# EAGLE design gps-iridium-tracker (EAGLE 6.4)
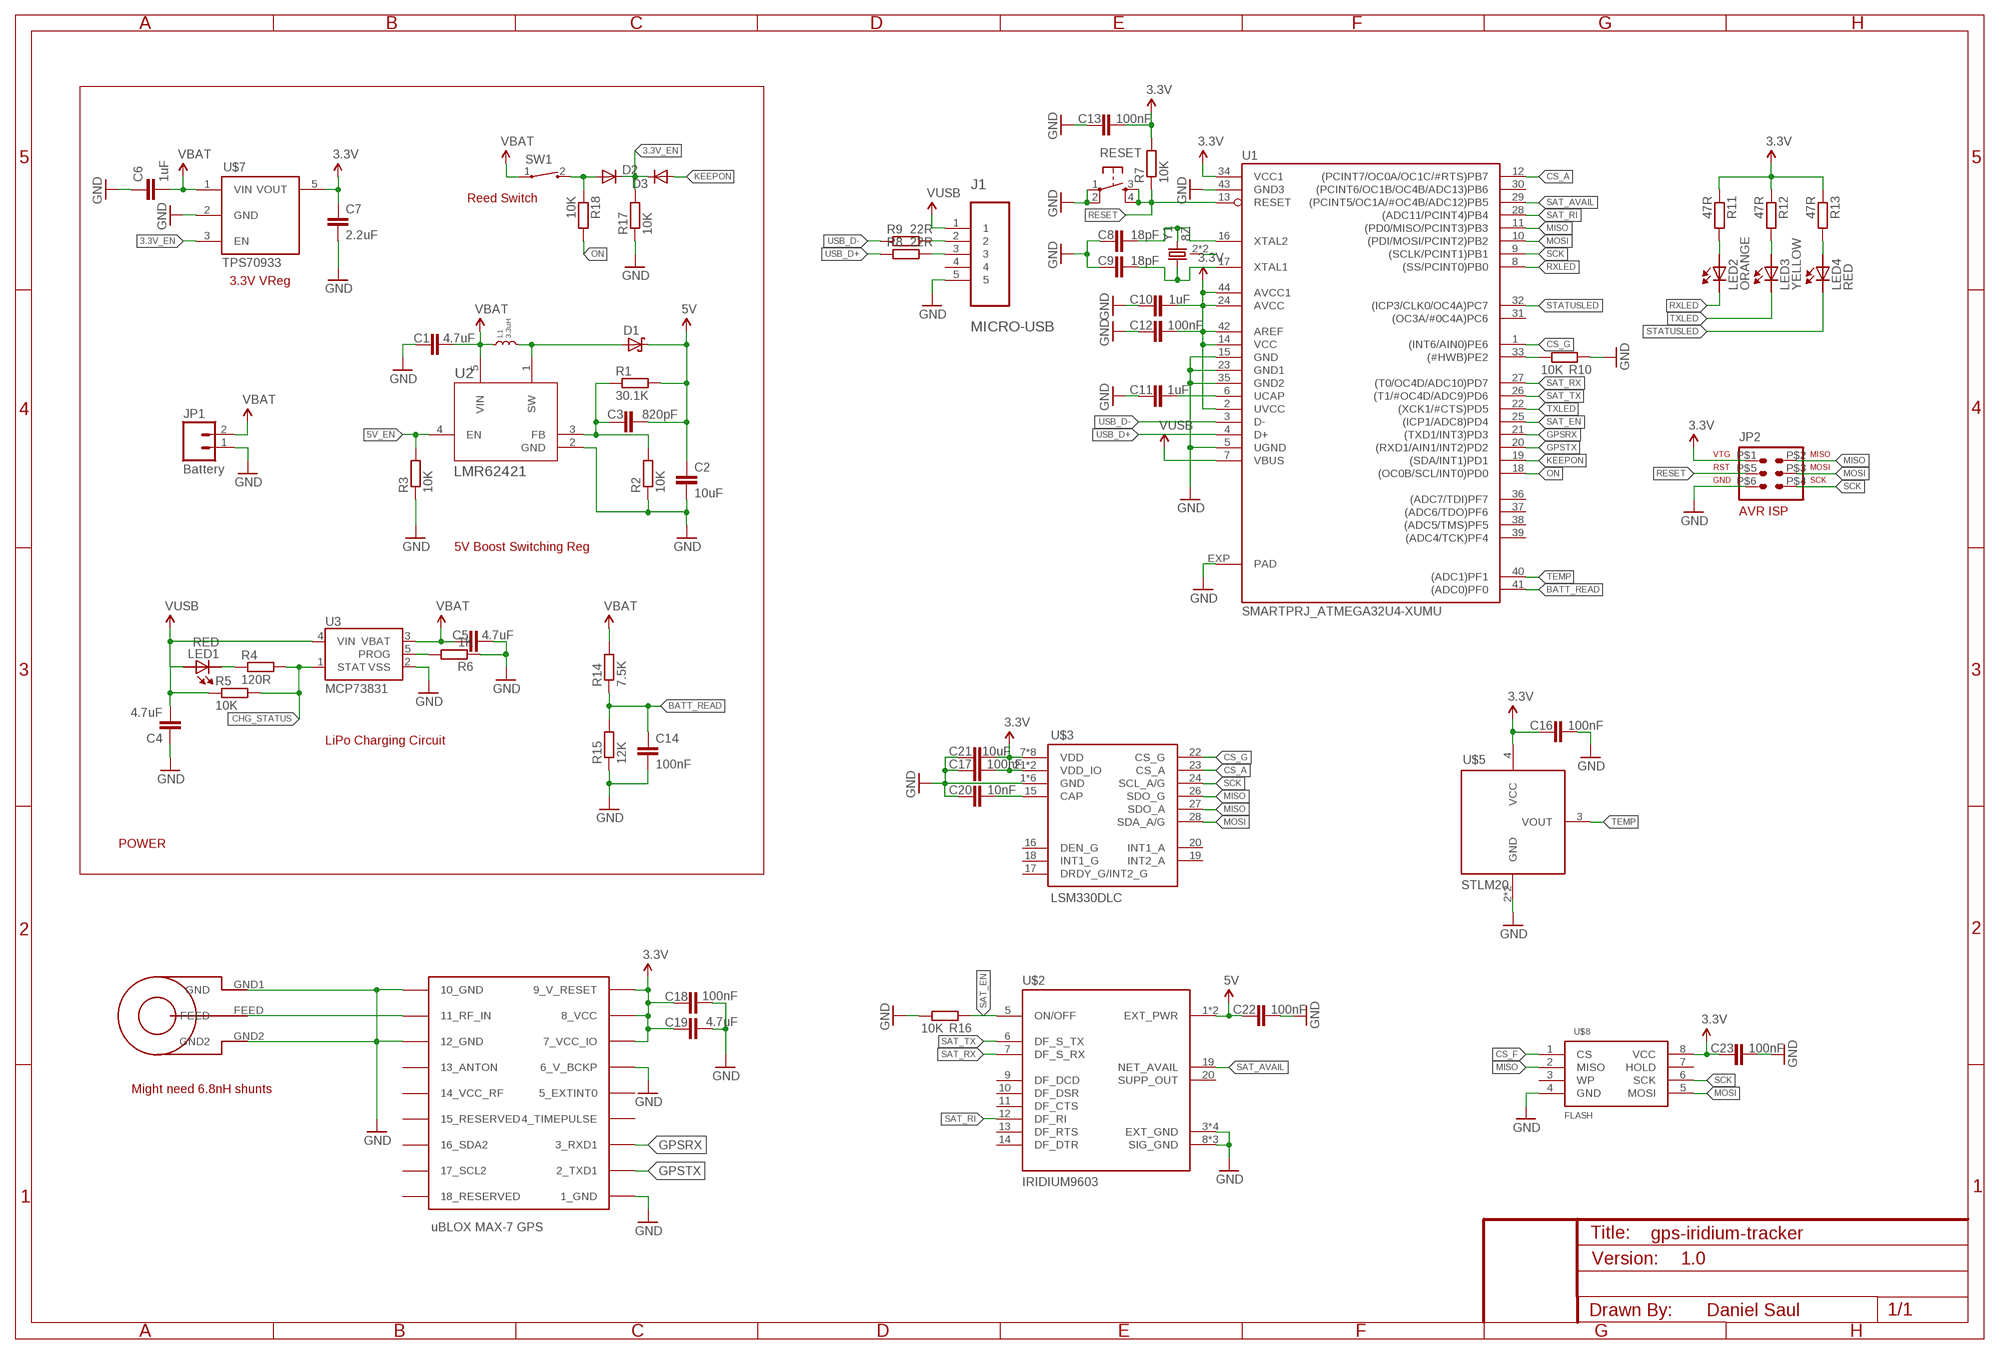
[diagram p0: schematic, sheet 1]

## Parts
C1  4.7uF  CAP0603-CAP  [0603-CAP]
C2  10uF  CAP0603-CAP  [0603-CAP]
C3  820pF  CAP0603-CAP  [0603-CAP]
C4  4.7uF  CAP0603-CAP  [0603-CAP]
C5  4.7uF  CAP0603-CAP  [0603-CAP]
C6  1uF  CAP0603-CAP  [0603-CAP]
C7  2.2uF  CAP0603-CAP  [0603-CAP]
C8  18pF  CAP0603-CAP  [0603-CAP]
C9  18pF  CAP0603-CAP  [0603-CAP]
C10  1uF  CAP0402-CAP  [0402-CAP]
C11  1uF  CAP0402-CAP  [0402-CAP]
C12  100nF  CAP0402-CAP  [0402-CAP]
C13  100nF  CAP0402-CAP  [0402-CAP]
C14  100nF  CAP0402-CAP  [0402-CAP]
C16  100nF  CAP0402-CAP  [0402-CAP]
C17  100nF  CAP0402-CAP  [0402-CAP]
C18  100nF  CAP0402-CAP  [0402-CAP]
C19  4.7uF  CAP0805  [0805]
C20  10nF  CAP0402-CAP  [0402-CAP]
C21  10uF  CAP0402-CAP  [0402-CAP]
C22  100nF  CAP0402-CAP  [0402-CAP]
C23  100nF  CAP0402-CAP  [0402-CAP]
D1  B220A-13-F  [SMA-DIODE]
D2  DIODESOD  [SOD-323]
D3  DIODESOD  [SOD-323]
GPS  UBLOX_MAX-6  [UBLOX_MAX-6]
J1  MICRO-USB  47346-0001  [MOLEX_47346-0001]
JP1  Battery  M02JST-PTH-2  [JST-2-PTH]
JP2  AVR-ISP-6SMD  [ICSPSMD]
L1  3.3uH  INDUCTOR-SRN3015  [SRN3015]
LED1  RED  LED  [R0402]
LED2  ORANGE  LED  [R0402]
LED3  YELLOW  LED  [R0402]
LED4  RED  LED  [R0402]
R1  30.1K  R-EU_R0402  [R0402]
R2  10K  R-EU_R0402  [R0402]
R3  10K  R-EU_R0402  [R0402]
R4  120R  R-EU_R0402  [R0402]
R5  10K  R-EU_R0402  [R0402]
R6  1K  R-EU_R0402  [R0402]
R7  10K  R-EU_R0402  [R0402]
R8  22R  R-EU_R0402  [R0402]
R9  22R  R-EU_R0402  [R0402]
R10  10K  R-EU_R0402  [R0402]
R11  47R  R-EU_R0402  [R0402]
R12  47R  R-EU_R0402  [R0402]
R13  47R  R-EU_R0402  [R0402]
R14  7.5K  R-EU_R0402  [R0402]
R15  12K  R-EU_R0402  [R0402]
R16  10K  R-EU_R0402  [R0402]
R17  10K  R-EU_R0402  [R0402]
R18  10K  R-EU_R0402  [R0402]
RESET  KMR441NGLFS  [KMR441NGLFS]
SW1  CT10-XXXX-G1  [CT10-XXXX-G1]
U1  SMARTPRJ_ATMEGA32U4-XUMU  [SMARTPRJ_QFN44ML7X7]
U2  LMR62421  LMR62421_DBV_5  [MF05A]
U3  MCP73831  [SOT23-5]
U$1  JTI_ANTENNA-1575AT54A0010  [JTI_ANTENNA-1575AT54A0010]
U$2  IRIDIUM9603  [IRIDIUM9603]
U$3  LSM330DLC  [LGA-28L]
U$5  STLM20  [SOT23-5L]
U$7  TPS70933  [SOT23-5L]
U$8  FLASH  SPI_FLASH-X25XXSMD  [SO08]
Y1  8Z  [8Z]

## Nets
3.3V: C7.1 C10.2 C12.2 C13.2 C16.1 C17.2 C18.1 C19.1 C21.2 C23.1 GPS.7_VCC_IO GPS.8_VCC GPS.9_V_RESET JP2.P$1 R7.2 R11.1 R12.1 R13.1 U1.2(UVCC) U1.14(VCC) U1.24(AVCC) U1.34(VCC1) U1.42(AREF) U1.44(AVCC1) U$3.7(VDD) U$3.8(VDD) U$3.9(VDD) U$3.10(VDD) U$3.11(VDD) U$3.12(VDD) U$3.13(VDD) U$3.14(VDD) U$3.21(VDD_IO) U$3.25(VDD_IO) U$5.4(VCC) U$7.5(VOUT) U$8.8(VCC)
3.3V_EN: D2.1(C) D3.1(C) R17.2 U$7.3(EN)
5V: C2.1 C3.2 C22.1 D1.2(C) R1.2 U$2.1(EXT_PWR) U$2.2(EXT_PWR)
5V_EN: R3.2 U2.4(EN)
BATT_READ: C14.1 R14.1 R15.2 U1.41((ADC0)PF0)
CHG_STATUS: R4.2 R5.2 U3.1(STAT)
CS_A: U1.12((PCINT7/OC0A/OC1C/#RTS)PB7) U$3.23(CS_A)
CS_F: U$8.1(CS)
CS_G: U1.1((INT6/AIN0)PE6) U$3.22(CS_G)
GND: C1.1 C2.2 C4.1 C5.2 C6.1 C7.2 C8.1 C9.1 C10.1 C11.1 C12.1 C13.1 C14.2 C16.2 C17.1 C18.2 C19.2 C20.1 C21.1 C22.2 C23.2 GPS.1_GND GPS.6_V_BCKP GPS.10_GND GPS.12_GND J1.5 JP1.1 JP2.P$6 R2.1 R3.1 R6.1 R10.1 R15.1 R16.2 R17.1 RESET.1(P) RESET.2(P1) U1.5(UGND) U1.15(GND) U1.23(GND1) U1.35(GND2) U1.43(GND3) U1.EXP(PAD) U2.2(GND) U3.2(VSS) U$1.GND1(GND) U$1.GND2 U$2.3(EXT_GND) U$2.4(EXT_GND) U$2.8(SIG_GND) U$2.15(SIG_GND) U$2.18(SIG_GND) U$2.HOLE1(EXT_GND) U$2.HOLE2(EXT_GND) U$3.1(GND) U$3.2(GND) U$3.3(GND) U$3.4(GND) U$3.5(GND) U$3.6(GND) U$5.2(GND) U$5.5(GND) U$7.2(GND) U$8.4(GND) Y1.2(GND) Y1.4(GND)
GPSRX: GPS.3_RXD1 U1.21((TXD1/INT3)PD3)
GPSTX: GPS.2_TXD1 U1.20((RXD1/AIN1/INT2)PD2)
KEEPON: D3.2(A) U1.19((SDA/INT1)PD1)
MISO: JP2.P$2 U1.11((PD0/MISO/PCINT3)PB3) U$3.26(SDO_G) U$3.27(SDO_A) U$8.2(MISO)
MOSI: JP2.P$3 U1.10((PDI/MOSI/PCINT2)PB2) U$3.28(SDA_A/G) U$8.5(MOSI)
N$1: GPS.11_RF_IN U$1.FEED
N$3: D1.1(A) L1.2 U2.1(SW)
N$4: C3.1 R1.1 R2.2 U2.3(FB)
N$5: LED1.1(C) R4.1
N$6: R6.2 U3.5(PROG)
N$8: C8.2 U1.16(XTAL2) Y1.3
N$9: C9.2 U1.17(XTAL1) Y1.1
N$10: C11.2 U1.6(UCAP)
N$11: J1.2 R9.2
N$12: J1.3 R8.2
N$13: R10.2 U1.33((#HWB)PE2)
N$14: C20.2 U$3.15(CAP)
N$15: LED4.2(A) R13.2
N$16: LED2.2(A) R11.2
N$17: LED3.2(A) R12.2
N$18: D2.2(A) R18.1 SW1.2
ON: R18.2 U1.18((OC0B/SCL/INT0)PD0)
RESET: JP2.P$5 R7.1 RESET.3(S) RESET.4(S1) U1.13(RESET)
RXLED: LED2.1(C) U1.8((SS/PCINT0)PB0)
SAT_AVAIL: U1.29((PCINT5/OC1A/#OC4B/ADC12)PB5) U$2.19(NET_AVAIL)
SAT_EN: R16.1 U1.25((ICP1/ADC8)PD4) U$2.5(ON/OFF)
SAT_RI: U1.28((ADC11/PCINT4)PB4) U$2.12(DF_RI)
SAT_RX: U1.27((T0/OC4D/ADC10)PD7) U$2.7(DF_S_RX)
SAT_TX: U1.26((T1/#OC4D/ADC9)PD6) U$2.6(DF_S_TX)
SCK: JP2.P$4 U1.9((SCLK/PCINT1)PB1) U$3.24(SCL_A/G) U$8.6(SCK)
STATUSLED: LED4.1(C) U1.32((ICP3/CLK0/OC4A)PC7)
TEMP: U1.40((ADC1)PF1) U$5.3(VOUT)
TXLED: LED3.1(C) U1.22((XCK1/#CTS)PD5)
USB_D+: R8.1 U1.4(D+)
USB_D-: R9.1 U1.3(D-)
VBAT: C1.2 C5.1 C6.2 JP1.2 L1.1 R14.2 SW1.1 U2.5(VIN) U3.3(VBAT) U$7.1(VIN)
VUSB: C4.2 J1.1 LED1.2(A) R5.1 U1.7(VBUS) U3.4(VIN)
Unconnected: GPS.4_TIMEPULSE GPS.5_EXTINT0 GPS.13_ANTON GPS.14_VCC_RF GPS.15_RESERVED GPS.16_SDA2 GPS.17_SCL2 GPS.18_RESERVED J1.4 U1.30((PCINT6/OC1B/OC4B/ADC13)PB6) U1.31((OC3A/#0C4A)PC6) U1.36((ADC7/TDI)PF7) U1.37((ADC6/TDO)PF6) U1.38((ADC5/TMS)PF5) U1.39((ADC4/TCK)PF4) U$2.9(DF_DCD) U$2.10(DF_DSR) U$2.11(DF_CTS) U$2.13(DF_RTS) U$2.14(DF_DTR) U$2.20(SUPP_OUT) U$3.16(DEN_G) U$3.17(DRDY_G/INT2_G) U$3.18(INT1_G) U$3.19(INT2_A) U$3.20(INT1_A) U$8.3(WP) U$8.7(HOLD)

## Notes on the sheet
- Reed Switch
- 3.3V VReg
- 5V Boost Switching Reg
- LiPo Charging Circuit
- POWER
- Might need 6.8nH shunts
- uBLOX MAX-7 GPS
- 1.0
- Daniel Saul

## Library data of the parts
C1-C14 C16 C17 C20-C23 = SparkFun-Passives:CAP: Capacitor Standard 0603 ceramic capacitor, and 0.1" leaded capacitor.
C18 C19 = apex:CAP: Capacitor Standard 0603 ceramic capacitor, and 0.1" leaded capacitor.
D1 = !danielparts:B220A-13-F
D2 D3 = apex:DIODE: Diode These are standard reverse protection diodes and small signal diodes. SMA package can handle up to about 1A. SOD-323 can handle about 200mA. What the SOD-323 package when ordering, there are some mfgs out there that are 5-pin packages.
GPS = Ava:UBLOX_MAX-6: UBLOX MAX-6
J1 = Molex-47346-0001:47346-0001: CONN RCPT 5POS MICRO USB R/A SMD; MPN: 47346-0001; OC_FARNELL: 1568026; OC_NEWARK: 47M0505; PACKAGE: 5 POS MICRO USB R/A; SUPPLIER: MOLEX
JP1 = SparkFun-Connectors:M02: Standard 2-pin 0.1" header. Use with - straight break away headers ( PRT-00116) - right angle break away headers (PRT-00553) - swiss pins (PRT-00743) - machine pins (PRT-00117) - female headers (PRT-00115) Molex polarized connector foot print use with: PRT-08233 with associated crimp pins and housings. 2.54_SCREWTERM for use with PRT-10571. 3.5mm Screw Terminal footprints for PRT-08084 5mm Screw Terminal footprints for use with PRT-08433
JP2 = apex:AVR-ISP-6: AVR ISP-6 Serial Programming Header
L1 = bourns:INDUCTOR
LED1-LED4 = apex:LED: SMD LED
R1-R18 = apex:R-EU_: RESISTOR, European symbol
RESET = apex:KMR441NGLFS
SW1 = switch-coto:CT10-XXXX-: CT10 Series Molded Switch Source: www.cotorelay.com .. Coto_Technology__CT10-1530-G1.pdf
U1 = gps-iridium-tracker:SMARTPRJ_ATMEGA32U4-XU
U2 = lmr62421:LMR62421_DBV_5; BASEPN: LMR62421; DATASHEETURL: http://www.ti.com/lit/ds/symlink/lmr62421.pdf; DESCRIPTION: SIMPLE SWITCHER 24Vout, 2.1A Step-Up Voltage Regulator in SOT-23; MANUFACTURER: Texas Instruments; MANUFACTURER_PART_NUMBER: lmr62421_dbv_5; NSC_PACKAGEREFERENCE: MF05A; VENDOR: Texas Instruments
U3 = SparkFun-PowerIC:MCP73831: Miniature single cell, fully integrated Li-Ion, Li-polymer charge management controller http://ww1.microchip.com/downloads/en/DeviceDoc/21984a.pdf IC-09995; PROD_ID: IC-09995
U$1 = Ava:JTI_ANTENNA-1575AT54A0010
U$2 = !danielparts:IRIDIUM9603
U$3 = LSM330DLC:LSM330DLC
U$5 = !danielparts:STLM20
U$7 = !danielparts:TPS70933
U$8 = SparkFun-DigitalIC:SPI_FLASH-X25XX: 8pin SPI Flash series x25xx. Works with devices like W25X32 and BR25L32
Y1 = !danielparts:8Z

## Board
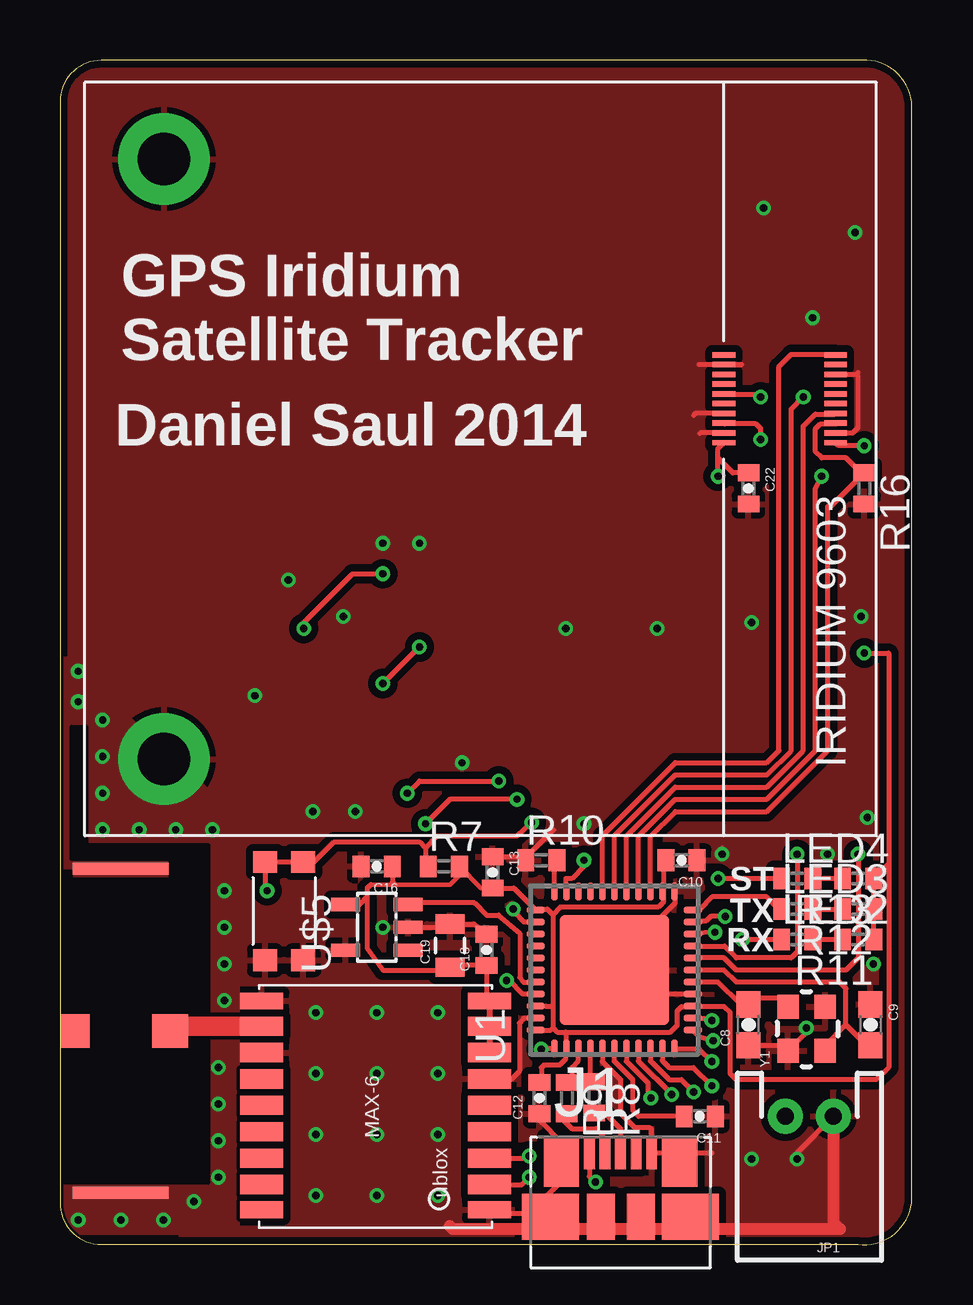
[diagram p1: board, top side]
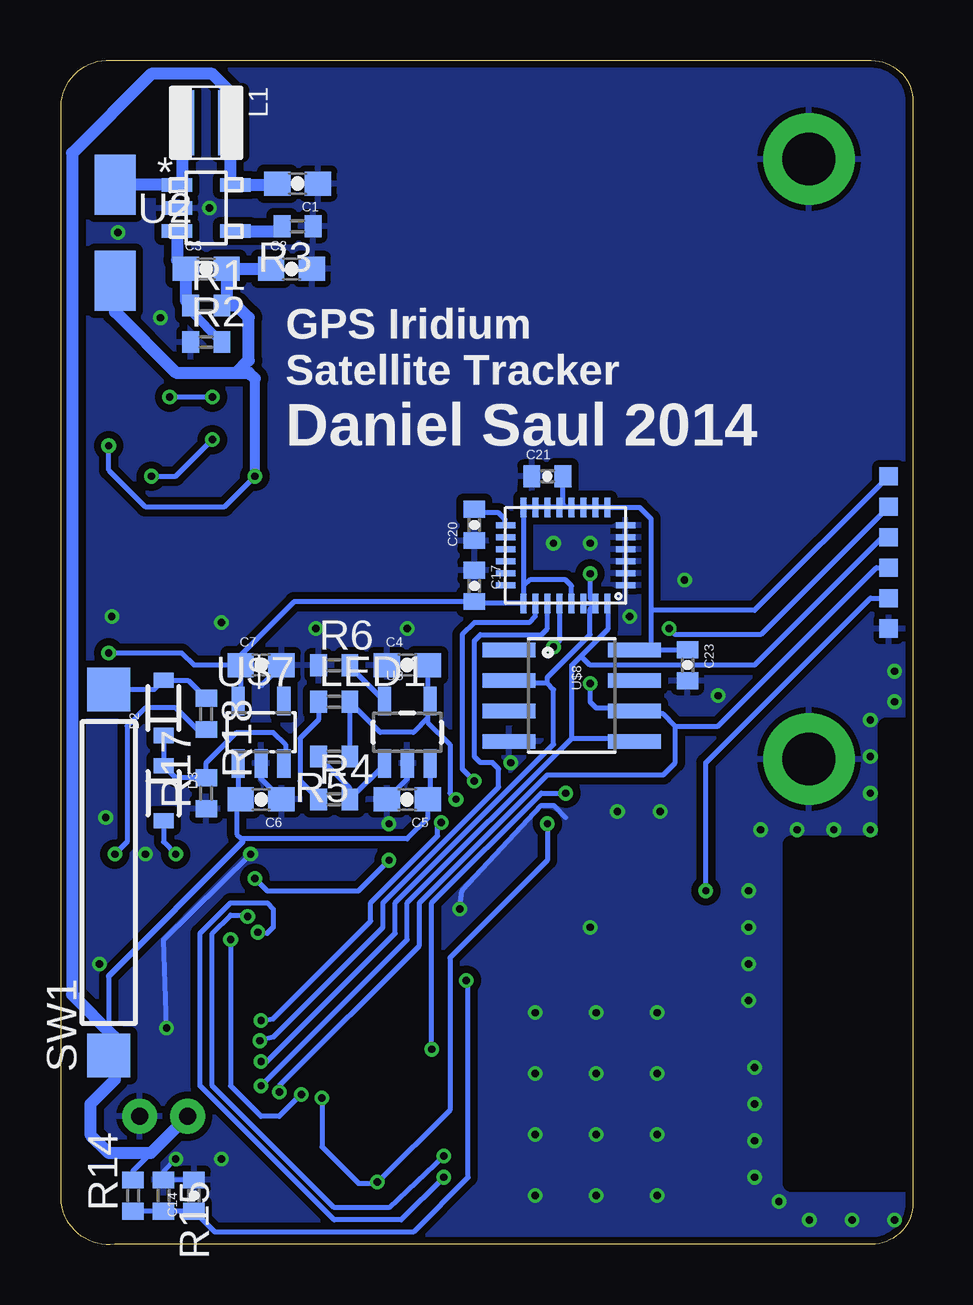
[diagram p2: board, bottom side, seen from below]

Size 35.51 x 49.36 mm. Coordinates in mm from the lower left corner, seen from the top.
Outline: 33.27,49.35 1.73,49.35 arc90 0,47.62 0,1.74 arc90 1.73,0.01 33.27,0.01 arc90 35.51,1.74 35.51,47.62 arc90 33.27,49.35
Copper layers (1*16): Top 0.035mm / dielectric 1.5mm / Bottom 0.035mm
Design rules "Fusion_eagle_rule_v1.1 *": minimum track width 6mil, minimum drill 12mil, track to track 6mil, track to pad 6mil, pad to pad 6mil, via to via 6mil, smd to smd 0mil, copper to edge 5mil, drill to drill 10mil, minimum pad ring 10mil, minimum via ring 6mil, stop-mask expansion 2mil, vias tented up to drill 100mil, thermal gap 10mil

### Footprints (pad centres in the part's own frame; a part is rotated, then mirrored left to right if it is on the bottom)
0603-CAP = smd 1.1 x 1: 1 -0.85,0; 2 0.85,0
0402-CAP = smd 0.7 x 0.9: 1 -0.65,0; 2 0.65,0
0805 = smd 0.8 x 1.2: 1 -0.9,0; 2 0.9,0
SMA-DIODE = smd 2.5 x 1.7: 1 -1.992,0.015; 2 2.008,0.015
SOD-323 = smd 0.63 x 0.83: 1 -1.15,0; 2 1.15,0
UBLOX_MAX-6 = smd 1.8 x 0.7: 1_GND 4.95,-4.4; 9_V_RESET 4.95,4.3; 10_GND -4.55,4.3; 18_RESERVED -4.55,-4.4 | smd 1.8 x 0.8: 2_TXD1 4.95,-3.35; 3_RXD1 4.95,-2.25; 4_TIMEPULSE 4.95,-1.15; 5_EXTINT0 4.95,-0.05; 6_V_BCKP 4.95,1.05; 7_VCC_IO 4.95,2.15; 8_VCC 4.95,3.25; 11_RF_IN -4.55,3.25; 12_GND -4.55,2.15; 13_ANTON -4.55,1.05; 14_VCC_RF -4.55,-0.05; 15_RESERVED -4.55,-1.15; 16_SDA2 -4.55,-2.25; 17_SCL2 -4.55,-3.35
MOLEX_47346-0001 = smd 0.45 x 1.38: 1 -1.3,0; 2 -0.65,0; 3 0,0; 4 0.65,0; 5 1.3,0 | smd 1.475 x 2.1: M1 -2.462,-0.36; M2 2.462,-0.36 | smd 2.375 x 1.9: M3 -2.913,-2.66; M6 2.913,-2.66 | smd 1.175 x 1.9: M4 -0.82,-2.66; M5 0.85,-2.66
JST-2-PTH = drill 0.7 pad 1.448: 1 -1,0; 2 1,0
ICSPSMD = smd 0.762 x 0.762: P$1 -1.27,0; P$2 0,0; P$3 1.27,0; P$4 2.54,0; P$5 3.81,0; P$6 5.08,0
SRN3015 = smd 2.7 x 1: 1 0,1; 2 0,-1
R0402 = smd 0.7 x 0.9: 1 -0.65,0; 2 0.65,0
KMR441NGLFS = smd 0.9 x 1: 1 2.132,0.746; 2 2.132,-0.854; 3 -1.968,0.746; 4 -1.968,-0.854
CT10-XXXX-G1 = smd 1.8 x 1.8: 1 -7.625,0; 2 7.625,0
SMARTPRJ_QFN44ML7X7 = smd 0.75 x 0.275: 1 -3.275,2.5; 2 -3.275,2; 3 -3.275,1.5; 4 -3.275,1; 5 -3.275,0.5; 6 -3.275,0; 7 -3.275,-0.5; 8 -3.275,-1; 9 -3.275,-1.5; 10 -3.275,-2; 11 -3.275,-2.5; 23 3.275,-2.5; 24 3.275,-2; 25 3.275,-1.5; 26 3.275,-1; 27 3.275,-0.5; 28 3.275,0; 29 3.275,0.5; 30 3.275,1; 31 3.275,1.5; 32 3.275,2; 33 3.275,2.5 | smd 0.275 x 0.75: 12 -2.5,-3.275; 13 -2,-3.275; 14 -1.5,-3.275; 15 -1,-3.275; 16 -0.5,-3.275; 17 0,-3.275; 18 0.5,-3.275; 19 1,-3.275; 20 1.5,-3.275; 21 2,-3.275; 22 2.5,-3.275; 34 2.5,3.275; 35 2,3.275; 36 1.5,3.275; 37 1,3.275; 38 0.5,3.275; 39 0,3.275; 40 -0.5,3.275; 41 -1,3.275; 42 -1.5,3.275; 43 -2,3.275; 44 -2.5,3.275 | smd 4.572 x 4.572: EXP 0,0
MF05A = smd 1.27 x 0.559: 1 -1.219,0.965; 2 -1.219,0; 3 -1.219,-0.965; 4 1.219,-0.965; 5 1.219,0.965
SOT23-5 = smd 0.55 x 1.2: 1 -0.95,-1.3; 2 0,-1.3; 3 0.95,-1.3; 4 0.95,1.3; 5 -0.95,1.3
JTI_ANTENNA-1575AT54A0010 = smd 1.5 x 1.4: FEED -2.05,0 | smd 4 x 0.5: GND1 0,6.75; GND2 0,-6.75 | smd 1.2 x 1.4: NC 1.9,0
IRIDIUM9603 = smd 0.229 x 0.94: 1 16.381,1.712; 2 16.381,6.36; 3 16.788,1.712; 4 16.788,6.36; 5 17.194,1.712; 6 17.194,6.36; 7 17.6,1.712; 8 17.6,6.36; 9 18.007,1.712; 10 18.007,6.36; 11 18.413,1.712; 12 18.413,6.36; 13 18.82,1.712; 14 18.82,6.36; 15 19.226,1.712; 16 19.226,6.36; 17 19.632,1.712; 18 19.632,6.36; 19 20.039,1.712; 20 20.039,6.36 | drill 2.2 pad 3.81: HOLE1 3.2,29.7; HOLE2 28.2,29.7
LGA-28L = smd 0.8 x 0.25: 1 2.5,-1.25; 2 2.5,-0.75; 3 2.5,-0.25; 4 2.5,0.25; 5 2.5,0.75; 6 2.5,1.25; 15 -2.5,1.25; 16 -2.5,0.75; 17 -2.5,0.25; 18 -2.5,-0.25; 19 -2.5,-0.75; 20 -2.5,-1.25 | smd 0.25 x 0.8: 7 1.75,2; 8 1.25,2; 9 0.75,2; 10 0.25,2; 11 -0.25,2; 12 -0.75,2; 13 -1.25,2; 14 -1.75,2; 21 -1.75,-2; 22 -1.25,-2; 23 -0.75,-2; 24 -0.25,-2; 25 0.25,-2; 26 0.75,-2; 27 1.25,-2; 28 1.75,-2
SOT23-5L = smd 0.55 x 1.2: 1 -0.95,-1.3; 2 0,-1.3; 3 0.95,-1.3; 4 0.95,1.3; 5 -0.95,1.3
SO08 = smd 0.61 x 2.21: 1 -1.905,-2.616; 2 -0.635,-2.616; 3 0.635,-2.616; 4 1.905,-2.616; 5 1.905,2.616; 6 0.635,2.616; 7 -0.635,2.616; 8 -1.905,2.616
8Z = smd 1 x 0.9: 1 -1.85,-0.4; 2 0,-0.4; 3 0,1.15; 4 -1.85,1.15

### Placement (x,y rotation side)
C1  25.65,44.21 180 bottom
C2  25.91,40.65 0 bottom
C3  29.46,40.65 0 bottom
C4  21.08,24.14 0 bottom
C5  21.08,18.56 180 bottom
C6  27.18,18.56 180 bottom
C7  27.18,24.14 0 bottom
C8  28.7,9.16 90 top
C9  33.78,9.16 270 top
C10  25.91,16.02 180 top
C11  26.67,5.35 180 top
C12  19.99,6.11 90 top
C13  18.03,15.51 270 top
C14  29.97,2.05 90 bottom
C16  13.21,15.76 180 top
C17  18.29,27.45 270 bottom
C18  17.78,12.28 90 top
C19  16.26,12.46 90 top
C20  18.29,29.99 90 bottom
C21  15.24,32.02 0 bottom
C22  28.7,31.51 270 top
C23  9.4,24.14 270 bottom
D1  33.27,42.18 270 bottom
D2  31.24,22.37 90 bottom
D3  31.24,18.81 270 bottom
GPS  12.95,5.86 0 top
J1  23.37,3.82 0 top
JP1  31.24,5.35 180 top
JP2  1.02,30.75 270 bottom
L1  29.46,46.75 270 bottom
LED1  24.13,22.62 0 bottom
LED2  30.73,12.71 0 top
LED3  30.73,13.98 0 top
LED4  30.73,15.25 0 top
R1  29.46,39.13 0 bottom
R2  29.46,37.61 0 bottom
R3  25.65,42.43 180 bottom
R4  24.13,18.56 0 bottom
R5  24.13,20.33 180 bottom
R6  24.13,24.14 0 bottom
R7  16,15.76 0 top
R8  22.28,6.14 270 top
R9  21.13,6.11 270 top
R10  20.07,16.02 0 top
R11  33.27,12.71 180 top
R12  33.27,13.98 180 top
R13  33.27,15.25 180 top
R14  32.51,2.05 90 bottom
R15  31.24,2.05 270 bottom
R16  33.53,31.51 270 top
R17  29.46,18.81 90 bottom
R18  29.46,22.11 270 bottom
RESET  9.4,13.98 270 top
SW1  33.53,15.51 90 bottom
U1  23.11,11.44 90 top
U2  29.46,43.19 0 bottom
U3  21.08,21.35 0 bottom
U$1  2.54,8.9 180 top
U$2  34.04,17.03 90 top
U$3  14.48,28.72 0 bottom
U$5  13.21,13.22 90 top
U$7  27.18,21.35 0 bottom
U$8  14.22,22.87 270 bottom
Y1  31.5,9.92 90 top

### Tracks (layer width: path | path; a pad name or v marks a point on that pad's centre or on a via)
3.3V  (via drill 0.3 pad 0.41)
  Top 0.178: 21.13,8.19 U1.2 | 19.85,8.96 U1.44 | U1.42 20.25,9.94 | C13.2 17.56,14.86 R7.2 16.65,15.4 16.26,15 13.97,15 12.95,15 | 19.88,13.98 U1.34
  Top 0.203: C13.2 18.93,14.86 U1.34 | C10.2 25.15,16.02 25.15,14.75 | 25.15,14.75 U1.24 | R11.1 R12.1 R13.1 34.54,15.87 | v33.53,24.65 34.54,24.65 34.54,15.87 | 34.54,15.87 34.54,7.38 34.04,6.87 28.19,6.87 27.94,7.13 27.94,9.67 27.69,9.92 26.41,9.92 U1.14 26.36,9.92 25.91,9.92 25.73,9.74 25.73,9.13 25.45,8.85 21.08,8.85 | 17.66,10.16 GPS.9_V_RESET 17.78,10.28 C18.1 16.33,11.63 C19.1 | 12.81,14.49 12.81,14.86 12.95,15 | 12.81,14.49 12.81,12.35 13.46,11.44 16.14,11.44 C19.1 | C19.1 | U$5.4 12.49,14.17 12.81,14.49 | C16.1 13.86,15.11 13.97,15 | C12.2 20.07,6.84 20.07,7.38 20.17,7.48 20.83,7.48 21.08,7.74 21.08,8.14 U1.2 21.11,8.82 21.08,8.85 | 25.15,14.75 25.15,14.26 24.94,14.06 20.85,14.06 20.55,13.76 | 20.55,13.76 20.55,9.92 | 20.55,9.92 20.55,9.03 | 20.55,9.03 20.73,8.85 21.08,8.85 | 19.88,13.98 20.32,13.98 20.55,13.76 | 20.25,9.94 20.52,9.94 20.55,9.92 | U1.44 20.46,8.94 20.55,9.03
  Top 0.254: GPS.9_V_RESET GPS.8_VCC GPS.7_VCC_IO
  Bottom 0.178: 28.03,22.75 U$7.5
  Bottom 0.203: 28.03,22.75 C7.1 28.45,24.14 | 28.45,24.14 29.97,24.14 30.48,24.65 v33.53,24.65 | U$3.11 U$3.10 U$3.9 U$3.8 U$3.7 11.4,30.72 10.92,30.24 10.92,26.43 | U$3.11 U$3.12 U$3.13 U$3.14 16.23,27.45 | 16.23,27.45 U$3.21 18.21,26.72 C17.2 25.8,26.8 28.45,24.14 | U$3.25 14.23,27.45 14.48,27.7 15.97,27.7 16.23,27.45 | U$3.11 14.59,30.85 C21.2 | U$8.8 10.92,24.78 | 10.92,24.78 10.18,24.78 C23.1 | 10.92,26.43 10.92,24.78 | JP2.P$1 6.6,26.43 10.92,26.43
3.3V_EN
  Bottom 0.203: D2.1 D3.1 30.74,19.46 R17.2 29.46,20.08 28.19,21.35 26.67,21.35 26.16,20.84 26.16,20.12 U$7.3
5V  (via drill 0.3 pad 0.41)
  Top 0.203: 27.43,32.78 27.43,33.17 U$2.2 | C22.1 28.05,32.16 27.43,32.78 | v33.53,33.29 32.45,33.29 U$2.1 | v27.43,32.02 27.43,32.78
  Bottom 0.203: v33.53,33.29 33.53,32.27 32,30.75 28.7,30.75 v27.43,32.02
  Bottom 0.406: v27.43,32.02 27.43,36.08
  Bottom 0.508: C2.1 C3.2 28.61,39.33 R1.2 28.19,39.13 27.69,38.62 27.69,36.84 28.19,36.34 | D1.2 33.26,38.86 30.73,36.34 28.19,36.34 | 28.19,36.34 27.69,36.34 27.43,36.08
5V_EN
  Bottom 0.508: U2.4 26.51,42.23 R3.2
BATT_READ  (via drill 0.3 pad 0.41)
  Top 0.203: U1.41 19.29,10.44 18.72,11.01 v18.62,11.01
  Bottom 0.203: R14.1 R15.2 C14.1 29.1,0.52 20.83,0.52 18.54,2.81 18.54,10.94 v18.62,11.01
CHG_STATUS
  Bottom 0.203: U3.1 22.03,20 R4.2 23.48,19.03 R5.2
CS_A  (via drill 0.3 pad 0.41)
  Top 0.203: v27.23,8.5 26.68,8.65 U1.12
  Bottom 0.203: v27.23,8.5 26.67,8.65 22.1,13.22 22.1,14.24 17.27,19.06 17.27,19.83 17.53,20.08 18.03,20.08 18.29,20.33 18.29,25.16 18.03,25.41 15.49,25.41 15.24,25.67 U$3.23
CS_G  (via drill 0.3 pad 0.41)
  Top 0.203: U1.1 20.09,8.17 v20.07,8.14 | v14.48,18.81 14.99,19.32 v18.29,19.32
  Bottom 0.203: v20.07,8.14 20.07,14.24 15.49,18.81 v14.48,18.81 | U$3.22 15.75,26.7 15.75,26.18 16,25.92 18.29,25.92 18.8,25.41 18.8,19.83 v18.29,19.32
GND  (via drill 0.3 pad 0.41)
  Top 0.178: v30.73,3.57 30.73,3.84
  Top 0.203: U$2.15 33.2,36.26 | 33.2,36.26 33.27,36.34 | U$2.3 33.04,33.82 33.27,34.05 33.27,36.18 33.2,36.26 | 30.73,3.84 JP1.1 | U$5.2 16.12,13.22 C19.2 17.28,13.36 C18.2 | C8.1 30.11,8.31 Y1.4 | C13.1 19.27,16.16 R10.1 19.42,16.13 20.57,17.29 | U$2.18 28.37,36.66 28.42,36.67 26.64,36.67 | U$2.4 26.69,33.82 26.67,33.8 | U$2.8 26.49,34.63 26.42,34.56 | C12.1 20.07,5.09 20.83,4.33 20.83,2.55 19.56,1.28 18.08,1.28 GPS.1_GND | Y1.4 30.41,8.07 | v27.61,16.27 27.61,16.52 | v31.11,9.03 31.11,8.84 Y1.4 | U1.35 19.34,13.44 18.9,13.88 v18.9,13.98 | U1.15 24.11,10.44 | 24.11,10.44 U1.EXP | 24.11,10.44 24.11,12.7 25.65,14.24 25.65,14.68 U1.23 | 27.18,3.82 J1.5 24.64,3.85 24.64,4.84 24.59,4.89 23.95,4.89 23.37,5.48 23.37,6.87 22.61,7.63 U1.5 | U1.43 19.34,9.44 19.3,9.41 19.3,9.39 19.15,9.23 19.15,7.23 18.8,6.87 17.94,6.87 GPS.6_V_BCKP
  Top 0.508: JP1.1 32.24,0.92 32.51,0.65 16.38,0.65 16.26,0.78
  Bottom 0.178: C14.2 R15.1 31.24,3.06 v30.73,3.57
  Bottom 0.203: U3.2 21.08,19.41 C5.2 | U$7.2 27.18,19.41 C6.1 | 27.18,23.29 C7.2 | v31.11,9.03 31.24,12.71 v27.61,16.27 | v18.9,13.98 18.8,14.75 15.49,18.3 14.99,18.3 14.48,17.79
  other vias: 1.78,17.29 3.3,17.29 4.83,17.29 6.6,7.38 6.6,5.86 6.6,4.33 6.6,2.81 5.59,1.79 4.32,1.03 2.54,1.03 0.76,1.03 6.35,17.29 6.86,14.75 6.86,13.22 6.86,11.7 6.86,10.17 1.78,18.81 1.78,20.33 1.78,21.86 0.76,22.62 0.76,23.89 10.67,2.05 10.67,4.59 10.67,7.13 10.67,9.67 13.21,2.05 13.21,4.59 13.21,7.13 13.21,9.67 15.75,9.67 15.75,7.13 15.75,4.59 15.75,2.05 14.99,29.22 13.46,29.22 11.81,26.18 8.13,22.87 16.76,20.08 13.46,13.22 33.91,11.7 28.83,3.57 33.66,17.79 10.54,18.05 12.32,18.05 32,16.27 24.89,25.67 21.08,25.67 21.84,17.54 31.37,38.62 33.15,42.18 29.34,43.19 33.4,26.18 9.53,27.7 28.83,25.92
  pour Top (isolate 0.305): 5.08,-0.24 5.08,18.56 35.56,18.56 35.56,-0.24
  pour Top (no thermals): -0.25,24.4 1.78,24.4 1.78,22.87 7.37,17.79 7.37,0.52 -0.25,0.52
  pour Top (isolate 0.305): -0.25,49.8 35.56,49.54 35.56,17.03 0.25,17.03 0,16.78 0,49.54
  pour Bottom (isolate 0.305): -0.25,49.8 36.32,49.8 36.32,-0.49 -0.51,-0.49 -0.51,49.54
GPSRX  (via drill 0.3 pad 0.41)
  Top 0.203: GPS.3_RXD1 19.34,3.61 v19.56,3.7 | v27.74,13.68 27.13,13.68 26.92,13.48 26.42,13.48 U1.21
  Bottom 0.203: v19.56,3.7 21.84,1.54 24.13,1.54 29.21,6.62 29.21,12.97 28.45,13.73 27.79,13.73 v27.74,13.68
GPSTX  (via drill 0.3 pad 0.41)
  Top 0.203: GPS.2_TXD1 19.26,2.51 v19.56,2.81 | v27.3,13.02 26.41,12.97 U1.20
  Bottom 0.203: v19.56,2.81 21.34,1.03 24.13,1.03 29.72,6.62 29.72,12.97 28.45,14.24 26.92,14.24 26.67,13.98 26.67,13.22 26.92,12.97 v27.3,13.02
KEEPON  (via drill 0.3 pad 0.41)
  Top 0.203: v30.73,16.27 30.73,12.21 30.48,11.95 28.19,11.95 27.7,12.44 U1.19
  Bottom 0.203: D3.2 31.24,16.78 v30.73,16.27
MISO  (via drill 0.3 pad 0.41)
  Top 0.203: U1.11 26.64,8.17 v27.18,7.63 | v10.16,25.67 10.16,25.92 12.19,27.95 v13.46,27.95
  Bottom 0.203: v27.18,7.63 26.92,7.63 21.59,12.97 21.59,14.24 14.99,20.84 14.99,23.13 15.24,23.38 | U$3.26 U$3.27 | 15.24,23.38 16.71,23.38 U$8.2 | 15.24,23.38 15.24,23.64 13.46,25.41 13.46,26.48 U$3.27 | v13.46,27.95 13.46,26.95 U$3.27 | JP2.P$2 6.35,25.41 9.91,25.41 v10.16,25.67
MOSI  (via drill 0.3 pad 0.41)
  Top 0.203: U1.10 25.11,7.67 25.4,7.38 26.42,7.38 v27.18,6.62
  Bottom 0.203: 14.22,21.1 21.08,14.24 21.08,12.71 v27.18,6.62 | 14.22,21.1 11.73,21.1 U$8.5 | 14.22,21.1 14.22,24.14 13.84,24.53 | 13.84,24.53 12.7,25.67 12.7,26.69 U$3.28 | JP2.P$3 1.27,29.48 6.6,24.14 13.46,24.14 13.84,24.53
N$1
  Top 0.254: 4.84,9.11 U$1.FEED
  Top 0.813: GPS.11_RF_IN 4.84,9.11
N$3
  Bottom 0.508: L1.2 30.46,44.38 U2.1 33.25,44.16 D1.1
N$4
  Bottom 0.381: R1.1 30.11,38.91 R2.2
  Bottom 0.508: U2.3 30.68,41.02 C3.1 30.31,39.33 R1.1
N$5
  Bottom 0.203: LED1.1 24.78,21.87 25.55,21.1 25.55,19.33 R4.1
N$6
  Bottom 0.203: R6.2 23.48,24.1 U3.5
N$8
  Top 0.203: Y1.3 30.18,10.26 28.96,10.26 C8.2 28.36,10.01 27.43,10.94 U1.16
N$9
  Top 0.203: 33.54,8.32 C9.2 33.36,8.56 32.77,9.16 | 32.77,9.16 32.77,10.68 32.51,10.94 28.19,10.94 27.69,11.44 U1.17 | Y1.1 31.9,8.29 32.77,9.16
N$10
  Top 0.203: U1.6 23.11,7.63 23.88,6.87 23.88,5.6 24.13,5.35 C11.2
N$11
  Top 0.203: R9.2 20.83,5.35 21.34,4.84 22.35,4.84 22.61,4.59 22.61,3.94 J1.2
N$12
  Top 0.203: R8.2 22.75,5.46 23.37,4.84 J1.3
N$13
  Top 0.203: U1.33 20.61,15.91 R10.2
N$14
  Bottom 0.203: U$3.15 17,29.99 17,30.22 17.27,30.49 18.15,30.49 C20.2
N$15
  Top 0.203: R13.2 LED4.2
N$16
  Top 0.203: R11.2 LED2.2
N$17
  Top 0.203: LED3.2 R12.2
N$18
  Bottom 0.203: SW1.2 31.62,23.13 D2.2 30.22,23.52 R18.1
ON  (via drill 0.3 pad 0.41)
  Top 0.203: v33.27,16.27 33.27,11.95 32.77,11.44 28.19,11.44 27.69,11.95 U1.18
  Bottom 0.203: R18.2 29.83,21.46 30.73,22.37 32,22.37 32.77,21.6 32.77,16.78 v33.27,16.27
RESET  (via drill 0.3 pad 0.41)
  Top 0.203: 15.24,16.52 14.99,16.78 11.43,16.78 10.6,15.95 RESET.3 RESET.4 8.54,14.84 v8.64,14.75 | 15.24,16.52 15.24,15.87 R7.1 | U1.13 27.15,9.44 v27.18,9.34 | 15.24,16.52 15.75,17.03 19.05,17.03 v19.66,17.59
  Bottom 0.203: v27.18,9.34 26.67,9.41 22.61,13.48 22.61,14.24 19.81,17.03 19.81,17.44 v19.66,17.59 | v8.64,14.75 8.64,20.08 1.78,26.94 JP2.P$5
RXLED  (via drill 0.3 pad 0.41)
  Top 0.203: U1.8 24.11,7.65 v25.5,6.26 | LED2.1 v28.45,12.71
  Bottom 0.203: v28.45,12.71 28.45,6.62 27.18,5.35 26.42,5.35 v25.5,6.26
SAT_AVAIL
  Top 0.203: U1.29 22.61,17.02 22.61,17.03 25.65,20.08 29.46,20.08 29.97,20.59 29.97,36.59 30.48,37.1 32.3,37.1 U$2.19
SAT_EN
  Top 0.203: U1.25 24.61,17.01 25.65,18.05 29.46,18.05 32,20.59 32,30.75 32.12,30.75 R16.1 33.39,32.16 32.77,32.78 31.75,32.78 31.5,33.03 31.5,34 31.7,34.2 32.3,34.2 U$2.5 32.35,34.2
SAT_RI  (via drill 0.3 pad 0.41)
  Top 0.203: U1.28 23.11,17.03 25.65,19.57 29.46,19.57 30.48,20.59 30.48,34.81 v30.99,35.32 | v29.21,35.32 29.11,35.32 29.01,35.42 27.7,35.42 U$2.12
  Bottom 0.203: v30.99,35.32 v29.21,35.32
SAT_RX
  Top 0.203: U1.27 23.61,17.02 25.65,19.06 29.46,19.06 30.99,20.59 30.99,34.1 31.5,34.61 32.3,34.61 U$2.7
SAT_TX  (via drill 0.3 pad 0.41)
  Top 0.203: U1.26 24.11,17.02 25.65,18.56 29.46,18.56 31.5,20.59 31.5,31.51 v31.75,32.02 | U$2.6 27.7,34.2 29.01,34.2 29.21,34 v29.21,33.54
  Bottom 0.203: v31.75,32.02 30.73,32.02 v29.21,33.54
SCK  (via drill 0.3 pad 0.41)
  Top 0.203: U1.9 24.61,7.66 25.4,6.87 25.91,6.87 v26.42,6.36 | v14.99,24.91 v13.46,23.38
  Bottom 0.203: v26.42,6.36 26.42,6.62 20.57,12.46 20.57,14.24 15.24,19.57 10.41,19.57 9.91,20.08 9.91,21.6 | U$3.24 14.73,25.16 v14.99,24.91 | 9.91,21.6 10.41,22.11 11.48,22.11 U$8.6 11.73,22.37 13.21,22.37 13.46,22.62 v13.46,23.38 | 9.91,21.6 8.13,21.6 1.52,28.21 JP2.P$4
STATUSLED  (via drill 0.3 pad 0.41)
  Top 0.203: LED4.1 v27.43,15.25 | v21.84,16.02 21.84,15.76 21.34,15.25 21.08,15.25 21.08,14.75 U1.32
  Bottom 0.203: v27.43,15.25 26.92,14.75 23.11,14.75 v21.84,16.02
TEMP
  Top 0.203: 14.51,14.27 U$5.3 14.57,14.24 17.27,14.24 17.78,13.73 18.29,13.73 19.18,12.97 19.18,11.14 19.3,10.96 19.3,10.94 U1.40
TXLED
  Top 0.203: LED3.1 29.97,13.98 29.46,14.49 27.18,14.49 26.67,13.98 26.43,13.98 U1.22
USB_D+
  Top 0.203: U1.4 22.1,8.15 22.1,6.96 R8.1
USB_D-
  Top 0.203: U1.3 21.59,8.15 21.59,7.63 21.34,7.38 21.34,6.96 R9.1
VBAT
  Bottom 0.203: U3.3 20.13,18.66 C5.1 20.23,17.76 21.08,16.91 27.99,16.91 | U$7.1 28.13,18.66 C6.2 28.19,18.39 28.19,17.11 27.99,16.91 | R14.2 32.51,3.08 JP1.2 | 27.99,16.91 27.94,16.78 | 33.53,11.19 SW1.1
  Bottom 0.229: 27.94,16.78 33.53,11.19
  Bottom 0.508: 30.24,5.62 JP1.2 31.77,3.82 33.53,3.82 34.29,4.59 34.29,5.86 33.27,6.87 33.27,7.89 | 33.27,7.89 SW1.1 | C1.2 26.55,44.16 U2.5 28.46,44.38 L1.1 28.46,48.04 29.21,48.78 31.75,48.78 35.05,45.48 35.05,10.43 33.27,8.65 33.27,7.89
VUSB  (via drill 0.3 pad 0.41)
  Top 0.203: U1.7 23.61,7.64 24.51,6.75 24.51,6.24 v24.64,6.11 | J1.1 22.07,2.84 v22.33,2.61 | v19.05,18.56 16.26,18.56 v15.24,17.54
  Bottom 0.203: C4.2 20.23,22.75 | 20.23,22.75 U3.4 | R5.1 LED1.2 22.21,21.35 20.83,21.35 20.23,21.95 | 20.23,22.75 20.23,21.95 | 20.23,21.95 20.23,21.77 19.3,20.84 19.3,18.81 v19.05,18.56 | v15.24,17.54 15.24,16.02 19.3,11.95 19.3,5.6 v22.33,2.61 22.38,2.55 23.11,2.55 24.64,4.08 v24.64,6.11

### Text on the board
tPlace: GPS Iridium / Satellite Tracker | Daniel Saul 2014 | ST | TX | RX
bPlace: GPS Iridium / Satellite Tracker | Daniel Saul 2014